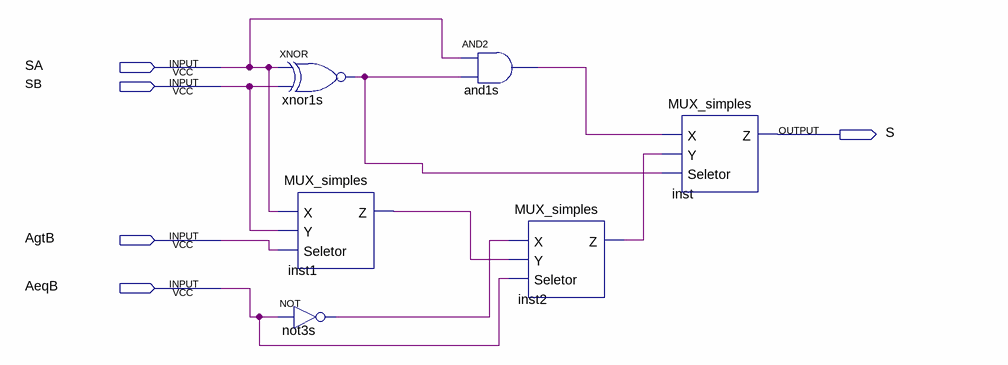
[diagram p0: schematic sheet]
// Quartus schematic tratar_sinal.bdf as structural Verilog: 6 symbols, 5 pins
module tratar_sinal (
  input  SA,
  input  SB,
  input  AgtB,
  input  AeqB,
  output S
);

  wire and1s_out, inst1_z, inst2_z, not3s_out, xnor1s_out;

  xnor xnor1s (xnor1s_out, SA, SB);
  MUX_simples inst1 (.X(SA), .Y(SB), .Seletor(AgtB), .Z(inst1_z));
  not not3s (not3s_out, AeqB);
  and and1s (and1s_out, SA, xnor1s_out);
  MUX_simples inst2 (.X(not3s_out), .Y(inst1_z), .Seletor(AeqB), .Z(inst2_z));
  MUX_simples inst (.X(and1s_out), .Y(inst2_z), .Seletor(xnor1s_out), .Z(S));
endmodule
